# Altium schematic sheet Main.SchDoc
size A4
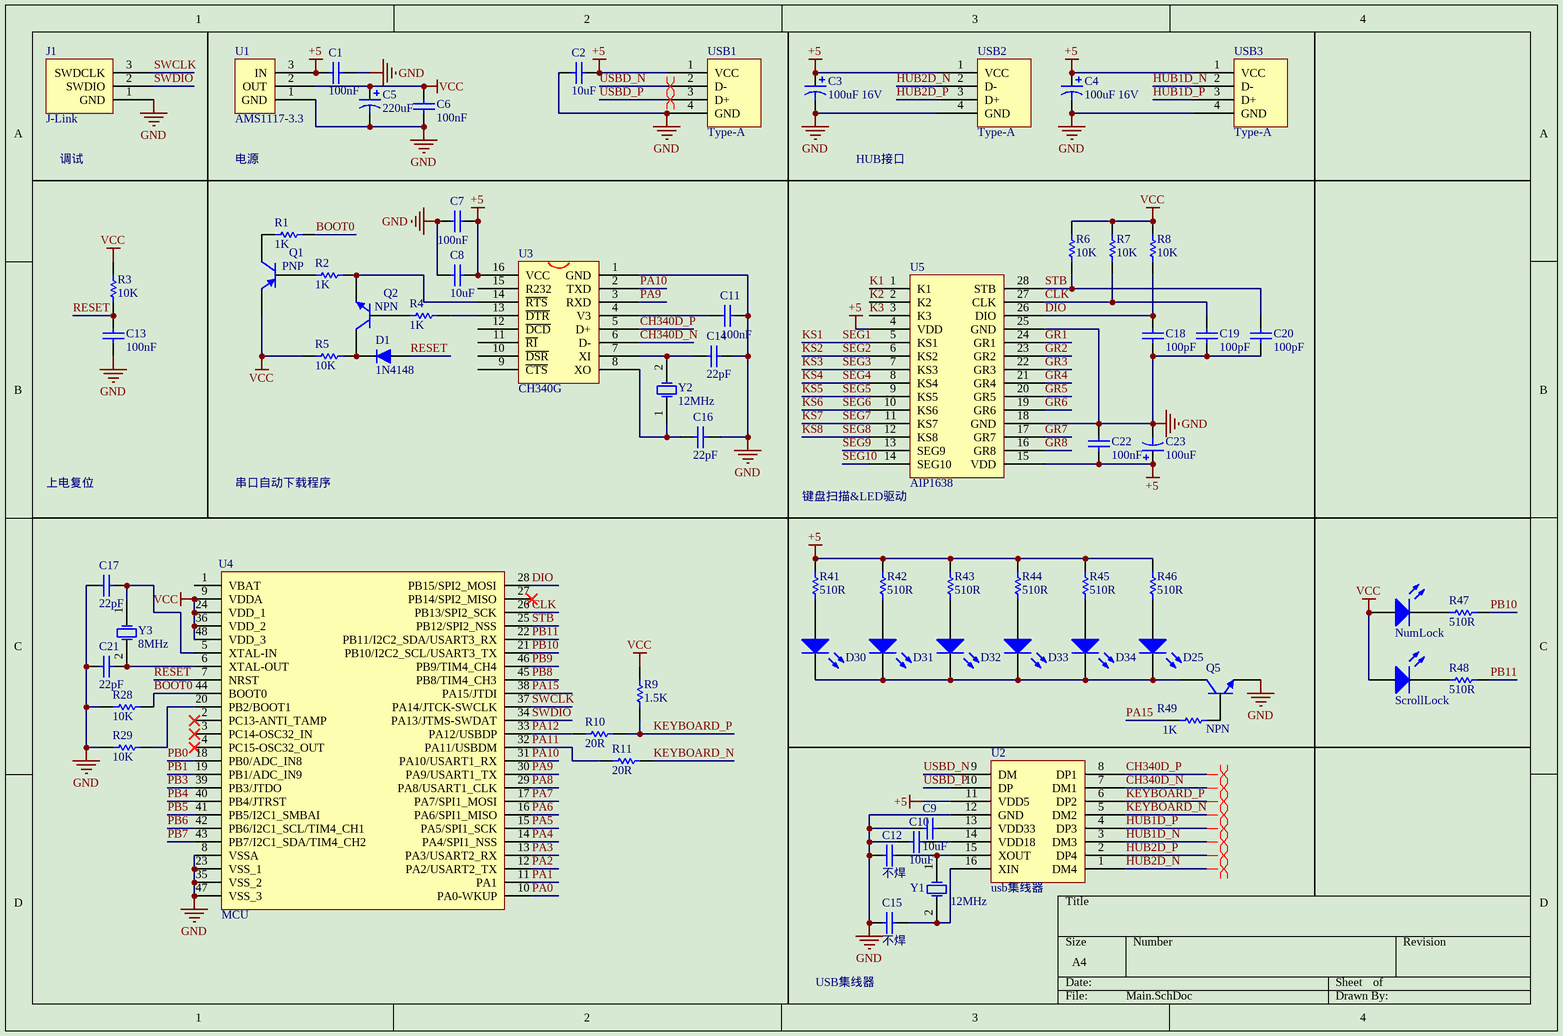
[diagram p0: Main.SchDoc]

## Parts
C1  100nF  [LC-1206_C]
C2  10uF  [LC-0603_C]
C3  100uF 16V  [贴片电解 6.3*5.4]
C4  100uF 16V  [贴片电解 6.3*5.4]
C5  220uF  [贴片电解 8*10.2]
C6  100nF  [LC-1206_C]
C7  100nF  [LC-1206_C]
C8  10uF  [LC-0603_C]
C9  10uF  [LC-0603_C]
C10  10uF  [LC-0603_C]
C11  100nF  [LC-1206_C]
C12  不焊  [LC-0603_C]
C13  100nF  [LC-1206_C]
C14  22pF  [LC-1206_C]
C15  不焊  [LC-0603_C]
C16  22pF  [LC-1206_C]
C17  22pF  [LC-1206_C]
C18  100pF  [LC-0603_C]
C19  100pF  [LC-0603_C]
C20  100pF  [LC-0603_C]
C21  22pF  [LC-1206_C]
C22  100nF  [LC-1206_C]
C23  100uF  [贴片电解 6.3*5.4]
D1  1N4148  [LC-DO-35]
D25  LED  [LC-0603_LED_S3]  (value not drawn)
D30  LED  [LC-0603_LED_S3]  (value not drawn)
D31  LED  [LC-0603_LED_S3]  (value not drawn)
D32  LED  [LC-0603_LED_S3]  (value not drawn)
D33  LED  [LC-0603_LED_S3]  (value not drawn)
D34  LED  [LC-0603_LED_S3]  (value not drawn)
J1  J-Link  [IDE3]
NumLock  LED  [LC-0603_LED_S3]  (value not drawn)
Q1  PNP  [LC-SOT-23(SOT-23-3)]
Q2  NPN  [LC-SOT-23(SOT-23-3)]
Q5  NPN  [LC-SOT-23(SOT-23-3)]
R1  1K  [LC-0603_R]
R2  1K  [LC-0603_R]
R3  10K  [LC-1206_R]
R4  1K  [LC-0603_R]
R5  10K  [LC-1206_R]
R6  10K  [LC-1206_R]
R7  10K  [LC-1206_R]
R8  10K  [LC-1206_R]
R9  1.5K  [LC-1206_R]
R10  20R  [LC-0603_R]
R11  20R  [LC-0603_R]
R28  10K  [LC-1206_R]
R29  10K  [LC-1206_R]
R41  510R  [LC-0603_R]
R42  510R  [LC-0603_R]
R43  510R  [LC-0603_R]
R44  510R  [LC-0603_R]
R45  510R  [LC-0603_R]
R46  510R  [LC-0603_R]
R47  510R  [LC-0603_R]
R48  510R  [LC-0603_R]
R49  1K  [LC-0603_R]
ScrollLock  LED  [LC-0603_LED_S3]  (value not drawn)
U1  AMS1117-3.3  [LC-SOT-223]
U2  usb集线器  [LC-SOP-16_150mil]
U3  CH340G  [LC-SOP-16_150mil]
U4  MCU  [lqfp48]
U5  AIP1638  [LC-SOP-28_300mil]
USB1  Type-A  [USB]
USB2  Type-A  [USB A型]
USB3  Type-A  [USB A型]
Y1  12MHz  [LC-HC-49S]
Y2  12MHz  [LC-HC-49S]
Y3  8MHz  [LC-HC-49S]

## Nets
+5: C1.2 C2.1 C3.1 C4.1 C7.2 C8.1 C22.1 C23.1 R41.2 R42.2 R43.2 R44.2 R45.2 R46.2 U1.3(IN) U2.11(VDD5) U3.16(VCC) U5.4(VDD) U5.15(VDD) USB1.1(VCC) USB2.1(VCC) USB3.1(VCC)
GND: C1.1 C2.2 C3.2 C4.2 C5.2 C6.2 C7.1 C8.2 C9.2 C10.2 C11.2 C12.2 C13.1 C14.2 C15.2 C16.2 C17.1 C18.1 C19.1 C20.1 C21.1 C22.2 C23.2 J1.1(GND) Q5.3(E) R28.1 R29.1 U1.1(GND) U2.12(GND) U3.1(GND) U4.8(VSSA) U4.23(VSS_1) U4.35(VSS_2) U4.47(VSS_3) U5.18(GND) U5.25(GND) USB1.4(GND) USB2.4(GND) USB3.4(GND)
VCC: C5.1 C6.1 NumLock.A Q1.3(E) R3.2 R5.1 R6.2 R7.2 R8.2 R9.2 ScrollLock.A U1.2(OUT) U4.9(VDDA) U4.24(VDD_1) U4.36(VDD_2) U4.48(VDD_3)
BOOT0: R1.2 R28.2 U4.44(BOOT0)
CH340D_N: U2.7(DM1) U3.6(D-)
CH340D_P: U2.8(DP1) U3.5(D+)
CLK: C19.2 R7.1 U4.26(PB13/SPI2_SCK) U5.27(CLK)
DIO: C18.2 R8.1 U4.28(PB15/SPI2_MOSI) U5.26(DIO)
GR1: U5.24(GR1)
GR2: U5.23(GR2)
GR3: U5.22(GR3)
GR4: U5.21(GR4)
GR5: U5.20(GR5)
GR6: U5.19(GR6)
GR7: U5.17(GR7)
GR8: U5.16(GR8)
HUB1D_N: U2.3(DM3) USB3.2(D-)
HUB1D_P: U2.4(DP3) USB3.3(D+)
HUB2D_N: U2.1(DM4) USB2.2(D-)
HUB2D_P: U2.2(DP4) USB2.3(D+)
K1: U5.1(K1)
K2: U5.2(K2)
K3: U5.3(K3)
KEYBOARD_N: R11.2 U2.5(DM2)
KEYBOARD_P: R9.1 R10.2 U2.6(DP2)
KS1: U5.5(KS1)  [also labelled SEG1]
KS2: U5.6(KS2)  [also labelled SEG2]
KS3: U5.7(KS3)  [also labelled SEG3]
KS4: U5.8(KS4)  [also labelled SEG4]
KS5: U5.9(KS5)  [also labelled SEG5]
KS6: U5.10(KS6)  [also labelled SEG6]
KS7: U5.11(KS7)  [also labelled SEG7]
KS8: U5.12(KS8)  [also labelled SEG8]
PA0: U4.10(PA0-WKUP)
PA1: U4.11(PA1)
PA2: U4.12(PA2/USART2_TX)
PA3: U4.13(PA3/USART2_RX)
PA4: U4.14(PA4/SPI1_NSS)
PA5: U4.15(PA5/SPI1_SCK)
PA6: U4.16(PA6/SPI1_MISO)
PA7: U4.17(PA7/SPI1_MOSI)
PA8: U4.29(PA8/USART1_CLK)
PA9: U3.3(RXD) U4.30(PA9/USART1_TX)
PA10: U3.2(TXD) U4.31(PA10/USART1_RX)
PA11: R11.1 U4.32(PA11/USBDM)
PA12: R10.1 U4.33(PA12/USBDP)
PA15: R49.1 U4.38(PA15/JTDI)
PB0: U4.18(PB0/ADC_IN8)
PB1: U4.19(PB1/ADC_IN9)
PB3: U4.39(PB3/JTDO)
PB4: U4.40(PB4/JTRST)
PB5: U4.41(PB5/I2C1_SMBAI)
PB6: U4.42(PB6/I2C1_SCL/TIM4_CH1)
PB7: U4.43(PB7/I2C1_SDA/TIM4_CH2)
PB8: U4.45(PB8/TIM4_CH3)
PB9: U4.46(PB9/TIM4_CH4)
PB10: R47.2 U4.21(PB10/I2C2_SCL/USART3_TX)
PB11: R48.2 U4.22(PB11/I2C2_SDA/USART3_RX)
RESET: C13.2 D1.1(A) R3.1 U4.7(NRST)
SEG9: U5.13(SEG9)
SEG10: U5.14(SEG10)
STB: C20.2 R6.1 U4.25(PB12/SPI2_NSS) U5.28(STB)
SWCLK: J1.3(SWDCLK) U4.37(PA14/JTCK-SWCLK)
SWDIO: J1.2(SWDIO) U4.34(PA13/JTMS-SWDAT)
USBD_N: U2.9(DM) USB1.2(D-)
USBD_P: U2.10(DP) USB1.3(D+)
NetC9_1: C9.1 U2.13(VDD33)
NetC10_1: C10.1 U2.14(VDD18)
NetC11_1: C11.1 U3.4(V3)
NetC12_1: C12.1 U2.15(XOUT) Y1.1(OSC1)
NetC14_1: C14.1 U3.7(XI) Y2.2(OSC2)
NetC15_1: C15.1 U2.16(XIN) Y1.2(OSC2)
NetC16_1: C16.1 U3.8(XO) Y2.1(OSC1)
NetC17_2: C17.2 U4.5(XTAL-IN) Y3.1(OSC1)
NetC21_2: C21.2 U4.6(XTAL-OUT) Y3.2(OSC2)
NetD1_2: D1.2(K) Q2.1(C) R5.2
NetD25_A: D25.A R46.1
NetD25_K: D25.K D30.K D31.K D32.K D33.K D34.K Q5.1(C)
NetD30_A: D30.A R41.1
NetD31_A: D31.A R42.1
NetD32_A: D32.A R43.1
NetD33_A: D33.A R44.1
NetD34_A: D34.A R45.1
NetNumLock_K: NumLock.K R47.1
NetQ1_1: Q1.1(C) R1.1
NetQ1_2: Q1.2(B) R2.1
NetQ2_2: Q2.2(B) R4.1
NetQ2_3: Q2.3(E) R2.2 U3.14(~{RTS})
NetQ5_2: Q5.2(B) R49.2
NetR4_2: R4.2 U3.13(~{DTR})
NetR29_2: R29.2 U4.20(PB2/BOOT1)
NetR48_1: R48.1 ScrollLock.K

Not connected (* = marked no-connect by the designer): U3 9(~{CTS}) 10(~{DSR}) 11(~{RI}) 12(~{DCD}) 15(R232); U4 1(VBAT) 2(PC13-ANTI_TAMP)* 3(PC14-OSC32_IN)* 4(PC15-OSC32_OUT)* 27(PB14/SPI2_MISO)*

## Layout directives
differential pair: CH340D_N, CH340D_P, HUB1D_N, HUB1D_P, HUB2D_N, HUB2D_P, KEYBOARD_N, KEYBOARD_P, USBD_N, USBD_P

## Notes on the sheet
- 调试
- 电源
- HUB接口
- 上电复位
- 串口自动下载程序
- 键盘扫描&LED驱动
- USB集线器

## Library data of the parts
C1 C2 C6-C13 C15 C18-C20 C22 = Capacitor: Value: 22pF; Published: 8-Jun-2000; LatestRevisionDate: 17-Jul-2002; LatestRevisionNote: Re-released for DXP Platform.; PackageReference: RAD-0.3; Publisher: Altium Limited; PackageDescription: Radial Cap, Thru-Hole; 2 Leads; 0.3 in Pin Spacing
C3-C5 C23 = Cap Pol: Polarized Capacitor (Axial); Value: 100pF; Published: 8-Jun-2000; LatestRevisionDate: 17-Jul-2002; LatestRevisionNote: Re-released for DXP Platform.; PackageReference: POLAR0.8; Publisher: Altium Limited; PackageDescription: Polarized Capacitor; 2 Leads
C14 C16 C17 C21 = Capacitor: Published: 8-Jun-2000; LatestRevisionDate: 17-Jul-2002; LatestRevisionNote: Re-released for DXP Platform.; PackageReference: RAD-0.3; Publisher: Altium Limited; PackageDescription: Radial Cap, Thru-Hole; 2 Leads; 0.3 in Pin Spacing; Value: 22pF
D1 = DO-214AC 肖特基
D25 D30-D34 NumLock ScrollLock = LED: Typical INFRARED GaAs LED; Published: 8-Jun-2000; LatestRevisionDate: 08-Jul-2005; LatestRevisionNote: Mech Layer 1 removed.; PackageReference: LED-0; Publisher: Altium Limited; PackageDescription: LED; 2 Leads
Q1 = PNP: PNP Bipolar Transistor; Published: 8-Jun-2000; LatestRevisionDate: 29-May-2009; LatestRevisionNote: IPC-7351 Footprint Added.; PackageVersion: Aug-1999; PackageReference: SOT-23B; Publisher: Altium Limited; PackageDescription: 3-Pin SOT-23 Package 0.95 mm Pitch, 2.4 mm Lead Span
Q2 Q5 = NPN: NPN Bipolar Transistor; Published: 8-Jun-2000; LatestRevisionDate: 17-Jul-2002; LatestRevisionNote: Re-released for DXP Platform.; PackageReference: TO-226-AA; Publisher: Altium Limited; PackageDescription: TO, Flat Index; 3 In-Line, Axial Leads; Body Dia. 4.8mm; Leads 0.55 x 0.51 mm (max); Code_JEDEC: TO-226-AA
R1-R11 R28 R29 R41-R49 = Resistor: Value: 150R; Published: 8-Jun-2000; LatestRevisionDate: 17-Jul-2002; LatestRevisionNote: Re-released for DXP Platform.; PackageReference: AXIAL-0.3; Publisher: Altium Limited; PackageDescription: Axial Device, Thru-Hole; 2 Leads; 0.3 in Pin Spacing
U1 = AMS1117
U2 = SL2.1A
U3 = CH340
U4 = STM32F103C8T6
USB1-USB3 = USB-A
Y1-Y3 = XTAL: Crystal Oscillator; Published: 8-Jun-2000; LatestRevisionDate: 17-Jul-2002; LatestRevisionNote: Re-released for DXP Platform.; PackageReference: R38; Publisher: Altium Limited; PackageDescription: Crystal, Thru-Hole; 2 Leads; Body 3.1 x 8.2 mm (Dia.xH)